# EAGLE schematic Crius co-16 (EAGLE 6.4)
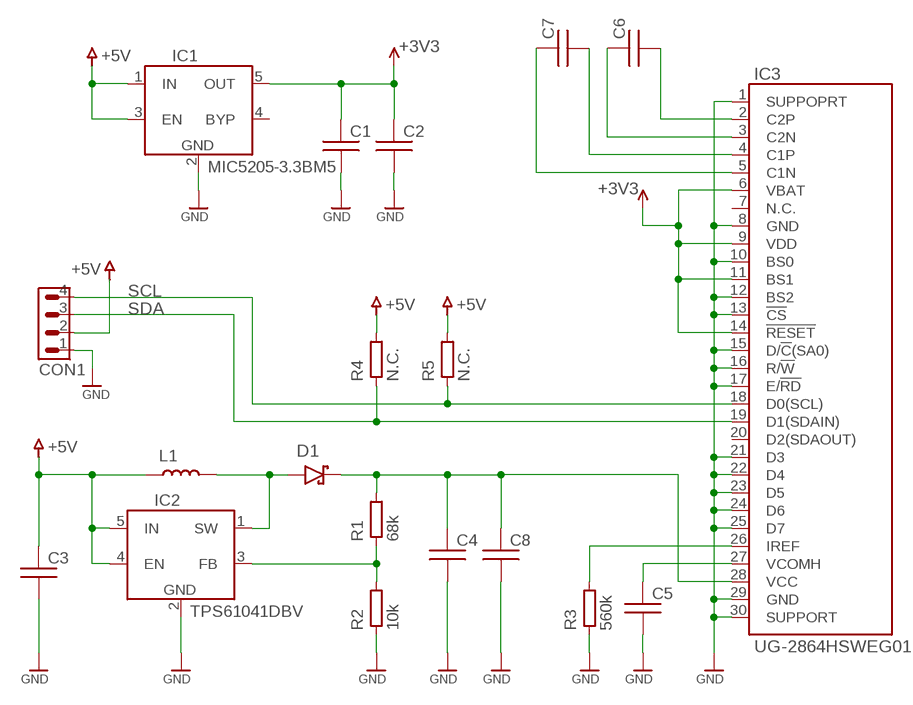
[diagram p0: schematic, sheet 1]

## Parts
C1  C1  [C1]
C2  C1  [C1]
C3  C1  [C1]
C4  C1  [C1]
C5  C1  [C1]
C6  C1  [C1]
C7  C1  [C1]
C8  C1  [C1]
CON1  PIN4X1  [PIN4X1]
D1  D-SHOTTKY-BAS70  [SOT23]
IC1  MIC5205-3.3BM5  [_DUMMY]
IC2  TPS61041DBV  [_DUMMY]
IC3  UG-2864HSWEG01  [_DUMMY]
L1  L3  [R3]
R1  68k  R-MINI1  [R1]
R2  10k  R-MINI1  [R1]
R3  560k  R-MINI1  [R1]
R4  N.C.  R-MINI1  [R1]
R5  N.C.  R-MINI1  [R1]

## Nets
+3V3: C1.1 C2.1 IC1.5(OUT) IC3.6(VBAT) IC3.9(VDD) IC3.11(BS1) IC3.14(!RESET)
+5V: C3.1 CON1.2 IC1.1(IN) IC1.3(EN) IC2.4(EN) IC2.5(IN) L1.1 R4.2 R5.2
GND: C1.2 C2.2 C3.2 C4.2 C5.2 C8.2 CON1.1 IC1.2(GND) IC2.2(GND) IC3.1(SUPPOPRT) IC3.8(GND) IC3.10(BS0) IC3.12(BS2) IC3.13(!CS) IC3.15(D/!C!(SA0)) IC3.16(R/!W) IC3.17(E/!RD) IC3.21(D3) IC3.22(D4) IC3.23(D5) IC3.24(D6) IC3.25(D7) IC3.29(GND) IC3.30(SUPPORT) R2.1 R3.1
N$1: C4.1 C8.1 D1.3(K) IC3.28(VCC) R1.2
N$2: C5.1 IC3.27(VCOMH)
N$3: D1.1(A) IC2.1(SW) L1.2
N$4: IC2.3(FB) R1.1 R2.2
N$5: IC3.26(IREF) R3.2
N$6: C6.2 IC3.2(C2P)
N$7: C6.1 IC3.3(C2N)
N$8: C7.2 IC3.4(C1P)
N$9: C7.1 IC3.5(C1N)
SCL: CON1.4 IC3.18(D0(SCL)) R5.1
SDA: CON1.3 IC3.19(D1(SDAIN)) R4.1
Unconnected: IC1.4(BYP) IC3.7(N.C.) IC3.20(D2(SDAOUT))

## Library data of the parts
C1-C8 = Pietrucha:C
CON1 = pins:PIN4X1
D1 = Pietrucha:D-SHOTTKY
IC1 = PN_IC:MIC5205
IC2 = PN_IC:TPS61041
IC3 = PN_opto:UG-2864HSWEG01
L1 = Pietrucha:L
R1-R5 = Pietrucha:R-MINI